# EAGLE design slave_03 (EAGLE 5.08)
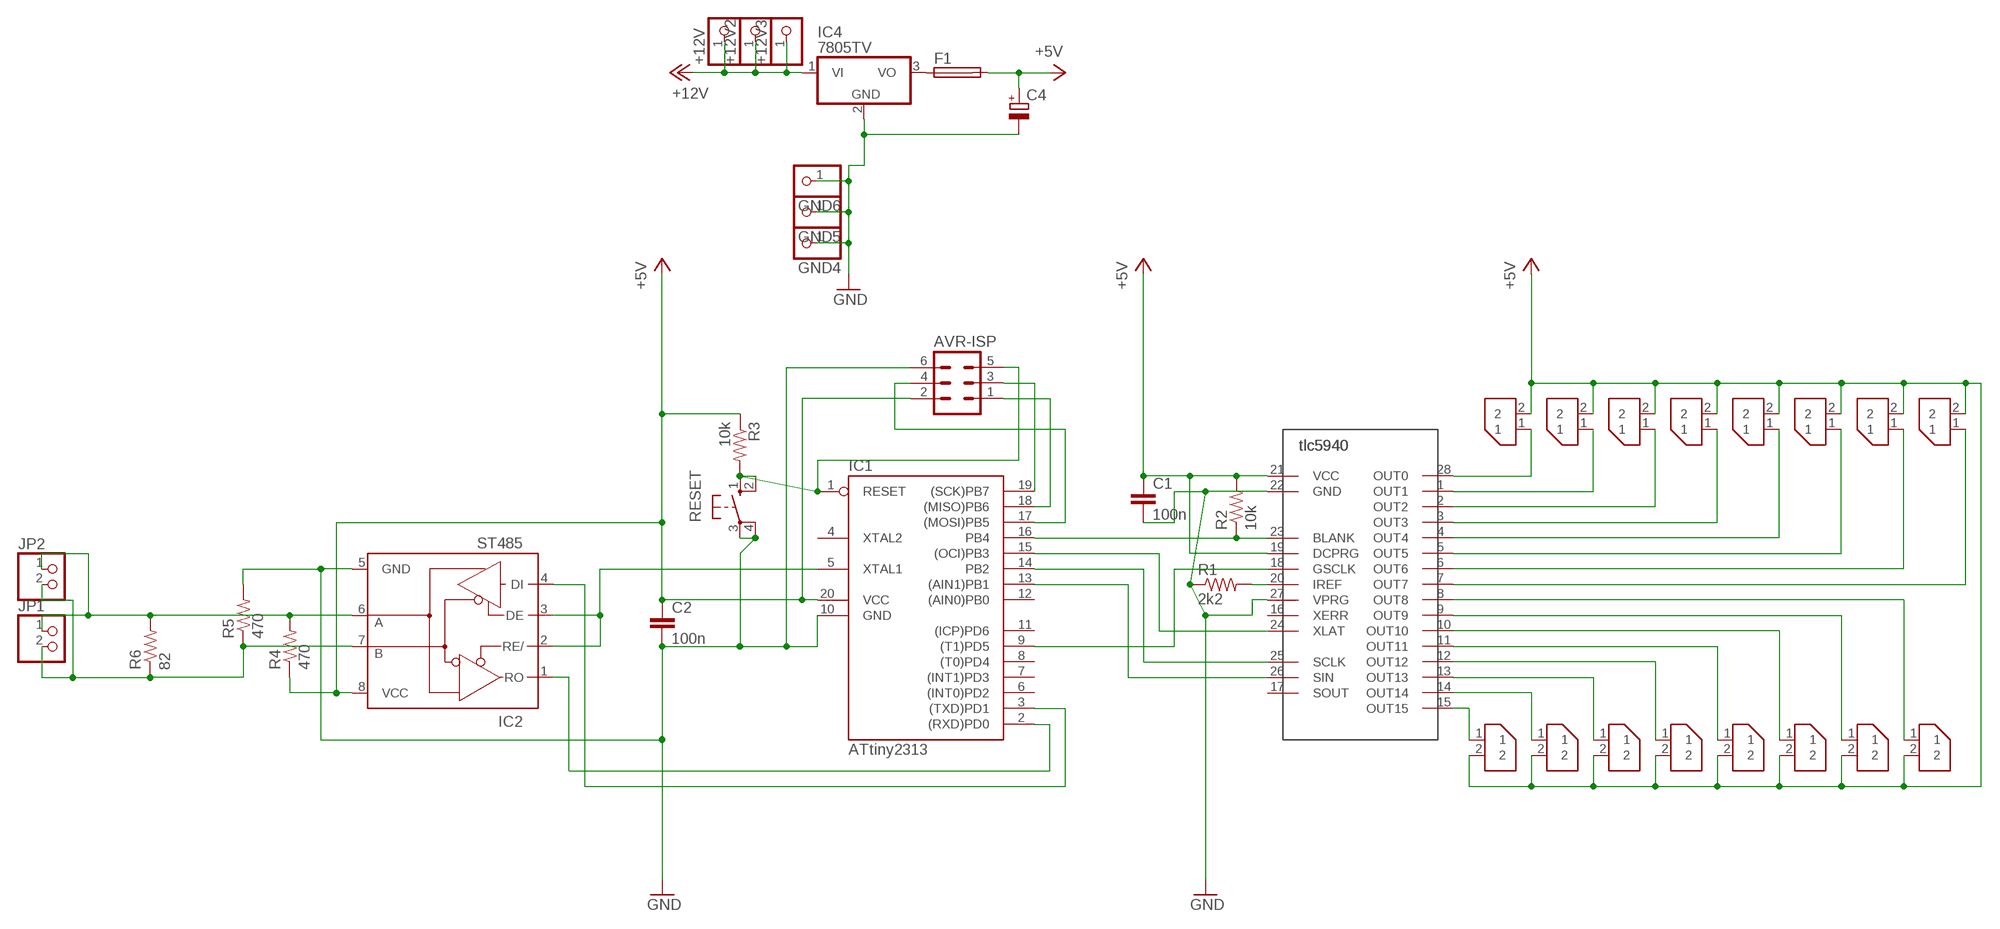
[diagram p0: schematic, sheet 1]

## Parts
+12V  PINHD-1X1  [1X01]
+12V2  PINHD-1X1  [1X01]
+12V3  PINHD-1X1  [1X01]
AVR-ISP  MA03-2  [MA03-2]
C1  100n  C5/2.5  [C5B2.5]
C2  100n  C2.5/2  [C2.5-2]
C4  CPOL-EUE5-5  [E5-5]
F1  SH22,5A  [SH22,5A]
GND4  PINHD-1X1  [1X01]
GND5  PINHD-1X1  [1X01]
GND6  PINHD-1X1  [1X01]
IC1  ATtiny2313  AT90S2313P  [DIL20]
IC2  ST485  MAX3468CPA  [DIL08]
IC4  7805TV  [TO220V]
JP1  PINHD-1X2  [1X02]
JP2  PINHD-1X2  [1X02]
R1  2k2  R-US_0204/7  [0204/7]
R2  10k  R-US_0207/10  [0207/10]
R3  10k  R-US_0204/7  [0204/7]
R4  470  R-US_0204/7  [0204/7]
R5  470  R-US_0204/7  [0204/7]
R6  82  R-US_0204/7  [0204/7]
RESET  10-XX  [B3F-10XX]
U$1  TLC5940-NT  [28-DIL-300]
U$2  SPOX-22-03-5025  [SPOX-22-03-5025]
U$3  SPOX-22-03-5025  [SPOX-22-03-5025]
U$4  SPOX-22-03-5025  [SPOX-22-03-5025]
U$5  SPOX-22-03-5025  [SPOX-22-03-5025]
U$6  SPOX-22-03-5025  [SPOX-22-03-5025]
U$7  SPOX-22-03-5025  [SPOX-22-03-5025]
U$8  SPOX-22-03-5025  [SPOX-22-03-5025]
U$9  SPOX-22-03-5025  [SPOX-22-03-5025]
U$10  SPOX-22-03-5025  [SPOX-22-03-5025]
U$11  SPOX-22-03-5025  [SPOX-22-03-5025]
U$12  SPOX-22-03-5025  [SPOX-22-03-5025]
U$13  SPOX-22-03-5025  [SPOX-22-03-5025]
U$14  SPOX-22-03-5025  [SPOX-22-03-5025]
U$15  SPOX-22-03-5025  [SPOX-22-03-5025]
U$16  SPOX-22-03-5025  [SPOX-22-03-5025]
U$17  SPOX-22-03-5025  [SPOX-22-03-5025]

## Nets
+5V: AVR-ISP.2 C1.1 C2.1 C4.+ F1.2 IC1.20(VCC) IC2.8(VCC) R2.2 R3.1 R4.1 U$1.19(DCPRG) U$1.21(VCC) U$2.2 U$3.2 U$4.2 U$5.2 U$6.2 U$7.2 U$8.2 U$9.2 U$10.2 U$11.2 U$12.2 U$13.2 U$14.2 U$15.2 U$16.2 U$17.2
+12V1: +12V2.1 +12V3.1 +12V.1 IC4.1(VI) ; supply symbol labelled +12V
GND: AVR-ISP.6 C1.2 C2.2 C4.- GND4.1 GND5.1 GND6.1 IC1.10(GND) IC2.5(GND) IC4.2(GND) R1.1 R5.2 RESET.3(P) RESET.4(P1) U$1.22(GND) U$1.27(VPRG)
N$1: IC1.15((OCI)PB3) U$1.24(XLAT)
N$2: IC1.16(PB4) R2.1 U$1.23(BLANK)
N$3: IC1.9((T1)PD5) U$1.18(GSCLK)
N$4: IC1.14(PB2) U$1.25(SCLK)
N$5: IC1.13((AIN1)PB1) U$1.26(SIN)
N$6: R1.2 U$1.20(IREF)
N$7: IC1.3((TXD)PD1) IC2.4(DI)
N$8: AVR-ISP.1 IC1.18((MISO)PB6)
N$10: IC1.2((RXD)PD0) IC2.1(RO)
N$11: AVR-ISP.3 IC1.19((SCK)PB7)
N$12: F1.1 IC4.3(VO)
N$13: U$1.28(OUT0) U$2.1
N$14: AVR-ISP.4 IC1.17((MOSI)PB5)
N$15: U$1.1(OUT1) U$3.1
N$16: U$1.2(OUT2) U$4.1
N$17: U$1.3(OUT3) U$5.1
N$18: U$1.15(OUT15) U$10.1
N$19: U$1.14(OUT14) U$11.1
N$20: U$1.13(OUT13) U$12.1
N$21: U$1.12(OUT12) U$13.1
N$22: U$1.11(OUT11) U$14.1
N$23: U$1.10(OUT10) U$15.1
N$24: U$1.9(OUT9) U$16.1
N$25: U$1.8(OUT8) U$17.1
N$26: U$1.4(OUT4) U$6.1
N$27: U$1.5(OUT5) U$7.1
N$28: U$1.6(OUT6) U$8.1
N$29: U$1.7(OUT7) U$9.1
N$31: AVR-ISP.5 IC1.1(RESET) R3.2 RESET.1(S) RESET.2(S1)
N$32: IC2.7(B) JP1.2 JP2.2 R5.1 R6.1
N$35: IC2.6(A) JP1.1 JP2.1 R4.2 R6.2
N$36: IC1.5(XTAL1) IC2.2(RE/) IC2.3(DE)
Unconnected: IC1.4(XTAL2) IC1.6((INT0)PD2) IC1.7((INT1)PD3) IC1.8((T0)PD4) IC1.11((ICP)PD6) IC1.12((AIN0)PB0) U$1.16(XERR) U$1.17(SOUT)

## Library data of the parts
+12V +12V2 +12V3 GND4-GND6 = pinhead:PINHD-1X1: PIN HEADER
AVR-ISP = con-lstb:MA03-2: PIN HEADER
C1 C2 = capacitor-wima:C: CAPACITOR naming: grid - package width
C4 = resistor:CPOL-EU: POLARIZED CAPACITOR, European symbol
F1 = fuse:SH22,5A: FUSE HOLDER grid 22,5mm, isolated cap OGN0031 8201, Schurter (Buerklin)
IC1 = atmel:AT90S2313: MICROCONTROLLER 2 Kbytes FLASH 128 bytes SRAM 128 bytes EEPROM UART
IC2 = maxim:MAX34*: +5V, Fail-Safe, 40Mbps, Profibus RS-485/RS-422 Transceivers Source: MAX3465-MAX3469.pdf
IC4 = linear:78*: Positive VOLTAGE REGULATOR Source: http://cache.national.com/ds/LM/LM78L05.pdf http://www.fairchildsemi.com/ds/LM/LM7805.pdf
JP1 JP2 = pinhead:PINHD-1X2: PIN HEADER
R1-R6 = resistor:R-US_: RESISTOR, American symbol
RESET = switch-omron:10-XX: OMRON SWITCH
U$1 = TLC5490:TLC5940-NT
U$2-U$17 = damians_bits:SPOX-22-03-5025: SPOX 22-03-5025

## Board
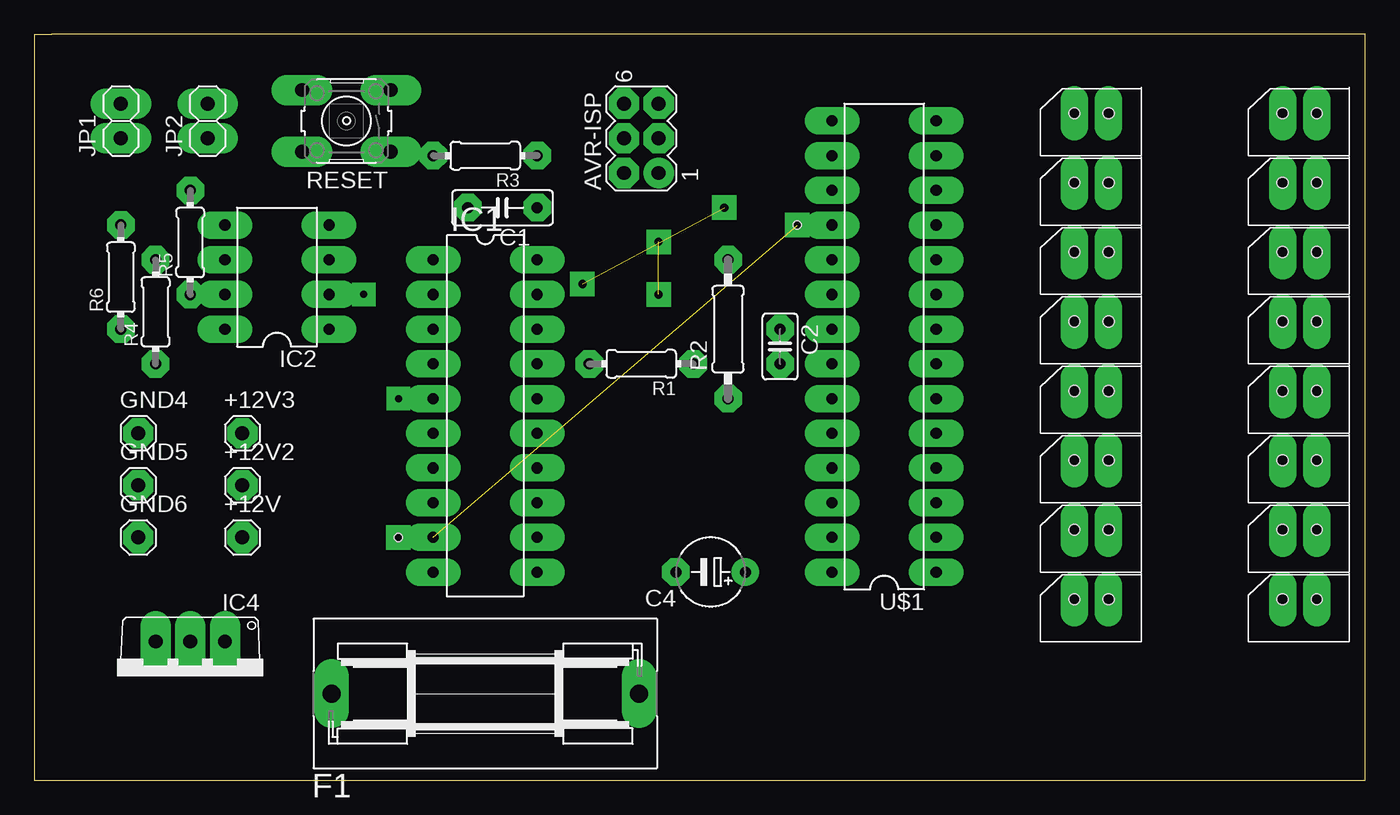
[diagram p1: board, top side]
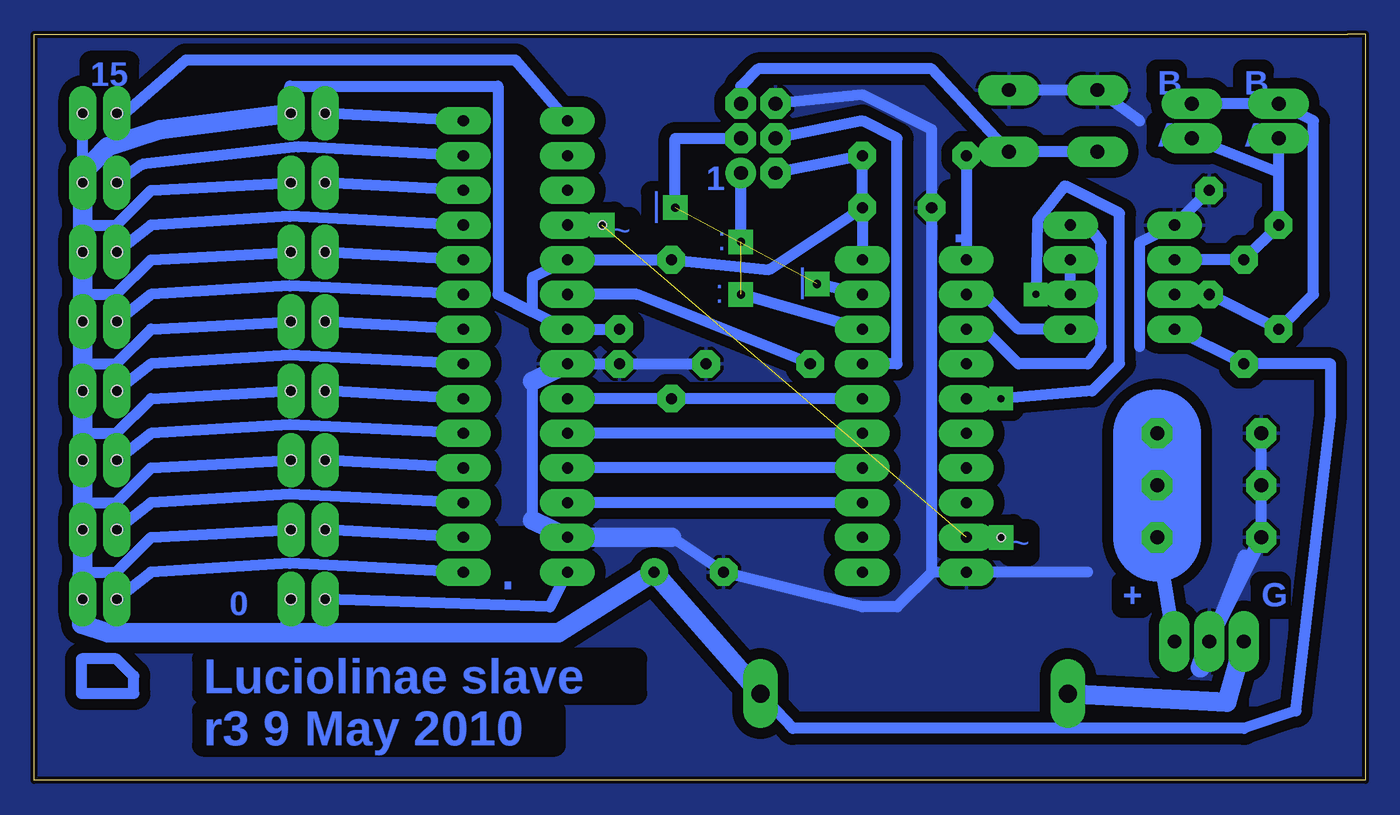
[diagram p2: board, bottom side, seen from below]

Size 97.46 x 54.61 mm. Coordinates in mm from the lower left corner, seen from the top.
Outline: 1.27,54.6 97.46,54.6 97.46,0 0,0 0,54.61 1.27,54.61
Copper layers (1*16): Top 0.035mm / dielectric 1.5mm / Bottom 0.035mm
Design rules "hobby": minimum track width 0.8mm, minimum drill 0.8mm, track to track 0.8mm, track to pad 0.8mm, pad to pad 0.45mm, via to via 0.8mm, smd to smd 8mil, copper to edge 10mil, drill to drill 8mil, minimum pad ring 0.6mm, minimum via ring 0.6mm, stop-mask expansion 0mil, vias tented up to drill 0mil, thermal gap 10mil
Holes 0.6 mm at 55.88,40.64 26.67,17.78

### Footprints (pad centres in the part's own frame; a part is rotated, then mirrored left to right if it is on the bottom)
1X01 = drill 1.016 octagon: 1 0,0
MA03-2 = drill 1.016 round: 1 -2.54,-1.27 | drill 1.016 octagon: 2 -2.54,1.27; 3 0,-1.27; 4 0,1.27; 5 2.54,-1.27; 6 2.54,1.27
C5B2.5 = drill 0.813 pad 1.6 octagon: 1 -2.54,0; 2 2.54,0
C2.5-2 = drill 0.813 pad 1.6 octagon: 1 -1.27,0; 2 1.27,0
E5-5 = drill 0.813 pad 1.905 round: + -2.54,0 | drill 0.813 pad 1.905 octagon: - 2.54,0
SH22,5A = drill 1.321 pad 2.54 long: 1 -11.252,0; 2 11.252,0
DIL20 = drill 0.813 long: 1 -11.43,-3.81; 2 -8.89,-3.81; 3 -6.35,-3.81; 4 -3.81,-3.81; 5 -1.27,-3.81; 6 1.27,-3.81; 7 3.81,-3.81; 8 6.35,-3.81; 9 8.89,-3.81; 10 11.43,-3.81; 11 11.43,3.81; 12 8.89,3.81; 13 6.35,3.81; 14 3.81,3.81; 15 1.27,3.81; 16 -1.27,3.81; 17 -3.81,3.81; 18 -6.35,3.81; 19 -8.89,3.81; 20 -11.43,3.81
DIL08 = drill 0.813 long: 1 -3.81,-3.81; 2 -1.27,-3.81; 3 1.27,-3.81; 4 3.81,-3.81; 5 3.81,3.81; 6 1.27,3.81; 7 -1.27,3.81; 8 -3.81,3.81
TO220V = drill 1.016 long: 1 -2.54,-2.54; 2 0,-2.54; 3 2.54,-2.54
1X02 = drill 1.016 long: 1 -1.27,0; 2 1.27,0
0204/7 = drill 0.813 octagon: 1 -3.81,0; 2 3.81,0
0207/10 = drill 0.813 octagon: 1 -5.08,0; 2 5.08,0
B3F-10XX = drill 1.016 long: 1 -3.251,2.261; 2 3.251,2.261; 3 -3.251,-2.261; 4 3.251,-2.261
28-DIL-300 = drill 0.813 long: 1 -15.24,-3.81; 2 -12.7,-3.81; 3 -10.16,-3.81; 4 -7.62,-3.81; 5 -5.08,-3.81; 6 -2.54,-3.81; 7 0,-3.81; 8 2.54,-3.81; 9 5.08,-3.81; 10 7.62,-3.81; 11 10.16,-3.81; 12 12.7,-3.81; 13 15.24,-3.81; 14 17.78,-3.81; 15 17.78,3.81; 16 15.24,3.81; 17 12.7,3.81; 18 10.16,3.81; 19 7.62,3.81; 20 5.08,3.81; 21 2.54,3.81; 22 0,3.81; 23 -2.54,3.81; 24 -5.08,3.81; 25 -7.62,3.81; 26 -10.16,3.81; 27 -12.7,3.81; 28 -15.24,3.81
SPOX-22-03-5025 = drill 0.8 long: 1 2.5,3.1; 2 5,3.1 | hole 0.8: 2.5,3.1; 5,3.1

### Placement (x,y rotation side)
+12V  15.24,17.78 0 top
+12V2  15.24,21.59 0 top
+12V3  15.24,25.4 0 top
AVR-ISP  44.45,46.99 90 top
C1  34.29,41.91 180 top
C2  54.61,31.75 270 top
C4  49.53,15.24 180 top
F1  33.02,6.35 0 top
GND4  7.62,25.4 0 top
GND5  7.62,21.59 0 top
GND6  7.62,17.78 0 top
IC1  33.02,26.67 270 top
IC2  17.78,36.83 90 top
IC4  11.43,7.62 180 top
JP1  6.35,48.26 90 top
JP2  12.7,48.26 90 top
R1  44.45,30.48 180 top
R2  50.8,33.02 90 top
R3  33.02,45.72 180 top
R4  8.89,34.29 90 top
R5  11.43,39.37 90 top
R6  6.35,36.83 90 top
RESET  22.86,48.26 180 top
U$1  62.23,30.48 90 top
U$2  73.66,10.16 0 top
U$3  88.9,10.16 0 top
U$4  73.66,15.24 0 top
U$5  88.9,15.24 0 top
U$6  73.66,20.32 0 top
U$7  88.9,20.32 0 top
U$8  73.66,25.4 0 top
U$9  88.9,25.4 0 top
U$10  88.9,45.72 0 top
U$11  73.66,45.72 0 top
U$12  88.9,40.64 0 top
U$13  73.66,40.64 0 top
U$14  88.9,35.56 0 top
U$15  73.66,35.56 0 top
U$16  88.9,30.48 0 top
U$17  73.66,30.48 0 top

### Tracks (layer width: path | path; a pad name or v marks a point on that pad's centre or on a via)
+5V
  Bottom 0.8: U$1.19 R2.2 | R3.1 AVR-ISP.2 | R4.1 IC2.8 | 2.54,26.67 5.08,5.08 8.89,3.81
  Bottom 0.813: U$4.2 88.9,17.78 91.44,15.24 93.9,15.24 U$3.2 | U$6.2 88.9,22.86 91.44,20.32 93.9,20.32 U$5.2 | U$7.2 93.9,25.4 91.44,25.4 88.9,27.94 U$8.2 | U$17.2 88.9,33.02 91.44,30.48 93.9,30.48 U$9.2 | U$15.2 88.9,38.1 91.44,35.56 93.9,35.56 U$16.2 | U$12.2 93.9,44.45 U$10.2 | U$14.2 93.9,40.64 91.44,40.64 88.9,43.18 U$13.2 | U$11.2 78.74,50.8 63.5,50.8 63.5,35.56 60.96,34.29 | C2.1 U$1.21 60.96,34.29 | 60.96,34.29 60.96,36.83 U$1.19 | C1.1 R3.1 | C1.1 43.68,37.37 R2.2 | C1.1 IC1.20 | R4.1 2.54,30.48 2.54,26.67 | F1.2 41.91,3.81 8.89,3.81
  Bottom 1.422: 78.74,10.79 U$2.2 | 78.74,10.79 92.08,10.79 93.98,11.43 93.92,12.7 | 93.92,12.7 U$3.2 | 93.92,12.7 93.9,17.78 | 93.9,17.78 U$5.2 | 93.9,17.78 93.9,22.86 | 93.9,22.86 U$7.2 | 93.9,22.86 93.9,27.94 U$9.2 U$16.2 U$14.2 U$12.2 | U$11.2 88.27,47.62 92.08,46.35 93.9,44.45 | 78.74,10.79 59.05,10.79 C4.+ F1.2
+12V1
  Bottom 1.016: IC4.1 +12V.1
  Bottom 6.452: +12V.1 +12V2.1 +12V3.1
GND
  Bottom 0.813: 60.96,19.05 60.96,29.21 | RESET.3 RESET.4 16.51,48.26 | R1.1 C2.2 U$1.22 | AVR-ISP.6 36.83,50.16 31.75,47.62 C1.2 31.75,15.24 | 31.75,15.24 IC1.10 20.32,15.24 | R5.2 IC2.5 16.51,39.37 16.51,31.75 | IC4.2 8.89,16.51 | 31.75,15.24 34.29,12.7 36.83,12.7 C4.- 50.8,17.78 | GND6.1 GND5.1 GND4.1
  Bottom 1.016: IC4.2 GND6.1
  Bottom 1.422: 60.96,29.21 U$1.22 | 60.96,19.05 U$1.27 50.8,17.78 | 12.06,8.26 IC4.2
  pour Bottom: 97.79,54.61 0,54.61 0,0 97.79,0
N$1
  Bottom 0.8: IC1.15 U$1.24
N$2
  Bottom 0.8: U$1.23 R2.1 IC1.16
N$3  (via drill 0.6)  (1 unrouted)
  Bottom 0.813: v55.88,40.64 U$1.18 | v26.67,17.78 IC1.9
N$4
  Bottom 0.8: IC1.14 U$1.25
N$5
  Bottom 0.8: IC1.13 U$1.26
N$6
  Bottom 0.8: U$1.20 53.34,35.56 R1.2
N$7
  Bottom 0.813: IC1.3 27.94,33.02 25.4,30.48 20.32,30.48 19.35,31.75 19.35,39.37 20.32,40.64 IC2.4
N$8  (via drill 0.6)  (1 unrouted)
  Bottom 0.813: IC1.18 v45.72,35.56 | v45.72,39.41 AVR-ISP.1
N$10
  Bottom 0.813: IC2.1 25.4,33.02 27.94,35.56 IC1.2
N$11  (via drill 0.6)  (1 unrouted)
  Bottom 0.813: IC1.19 v40.14,36.33 | AVR-ISP.3 50.53,46.99 v50.53,41.91
N$12
  Bottom 1.422: IC4.3 10.16,5.71 F1.1
N$13
  Bottom 0.813: U$1.28 59.69,12.7 U$2.1
N$14
  Bottom 0.8: IC1.17 34.29,30.48 34.29,46.99 36.83,48.26 AVR-ISP.4
N$15
  Bottom 0.813: U$3.1 88.9,15.24 78.74,15.88 U$1.1
N$16
  Bottom 0.813: U$1.2 U$4.1
N$17
  Bottom 0.813: U$5.1 88.9,20.32 78.74,20.95 U$1.3
N$18
  Bottom 0.813: U$1.15 62.23,52.7 86.36,52.7 91.44,48.26 U$10.1
N$19
  Bottom 0.813: U$1.14 U$11.1
N$20
  Bottom 0.813: U$12.1 89.53,45.09 78.11,46.35 U$1.13
N$21
  Bottom 0.813: U$1.12 U$13.1
N$22
  Bottom 0.813: U$1.11 78.74,41.27 88.9,40.64 U$14.1
N$23
  Bottom 0.813: U$1.10 U$15.1
N$24
  Bottom 0.813: U$16.1 88.9,35.56 78.74,36.2 U$1.9
N$25
  Bottom 0.813: U$1.8 U$17.1
N$26
  Bottom 0.813: U$1.4 U$6.1
N$27
  Bottom 0.813: U$7.1 88.9,25.4 78.74,26.04 U$1.5
N$28
  Bottom 0.813: U$1.6 U$8.1
N$29
  Bottom 0.813: U$9.1 88.9,30.48 78.74,31.11 U$1.7
N$30
  Bottom 0.813: 91.44,8.89 93.98,8.89 93.98,6.35 90.17,6.35 90.17,7.62 91.44,8.89
N$31
  Bottom 0.8: AVR-ISP.5 45.72,50.8 44.45,52.07 31.75,52.07
  Bottom 0.813: RESET.1 R3.2 IC1.1 | RESET.1 31.75,52.07 | RESET.2 RESET.1
N$32
  Bottom 0.8: R5.1 IC2.7
  Bottom 0.813: R5.1 R6.1 3.81,35.56 3.81,48.26 JP1.2 JP2.2
N$33
  pour Bottom: -12.7,67.31 0,67.31 0,-10.16 -12.7,-10.16
  pour Bottom: 93.98,67.31 110.49,67.31 110.49,-10.16 93.98,-10.16
N$34
  pour Bottom: 109.22,67.31 0,67.31 0,54.61 109.22,54.61
  pour Bottom: 110.49,11.43 0,11.43 -1.27,-10.16 109.22,-10.16
N$35
  Bottom 0.8: R6.2 R4.2 IC2.6
  Bottom 0.813: 6.35,44.45 JP1.1 | R6.2 6.35,44.45 | 6.35,44.45 JP2.1
N$36  (via drill 0.51)
  Bottom 0.813: IC2.3 IC2.2 v24.13,35.56 24,41 22,43.5 18,41.5 18,30.5 20,28.5 v26.67,27.94 IC1.5

### Text on the board
Bottom: 15 | B | B | A | A | 1 | | | . | : | ~ | | | : | ~ | . | G | + | 0 | Luciolinae slave | r3 9 May 2010